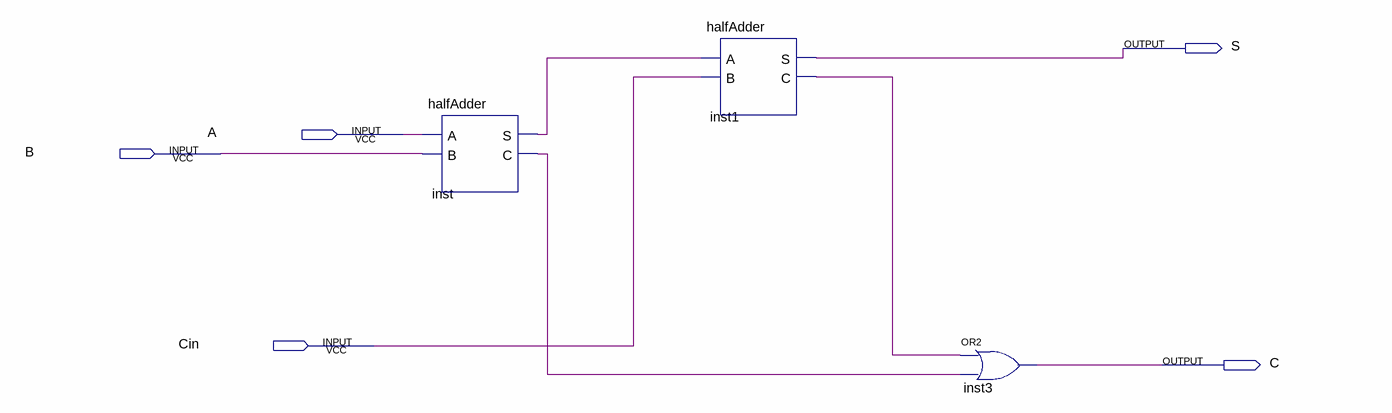
[diagram p0: schematic sheet]
// Quartus schematic fullAdder.bdf as structural Verilog: 3 symbols, 5 pins
module fullAdder (
  input  A,
  input  B,
  input  Cin,
  output S,
  output C
);

  wire inst1_c, inst_c, inst_s;

  halfAdder inst (.A(A), .B(B), .S(inst_s), .C(inst_c));
  halfAdder inst1 (.A(inst_s), .B(Cin), .S(S), .C(inst1_c));
  or inst3 (C, inst1_c, inst_c);
endmodule
